# Altium schematic sheet Barrido de temperatura.SchDoc
size A4
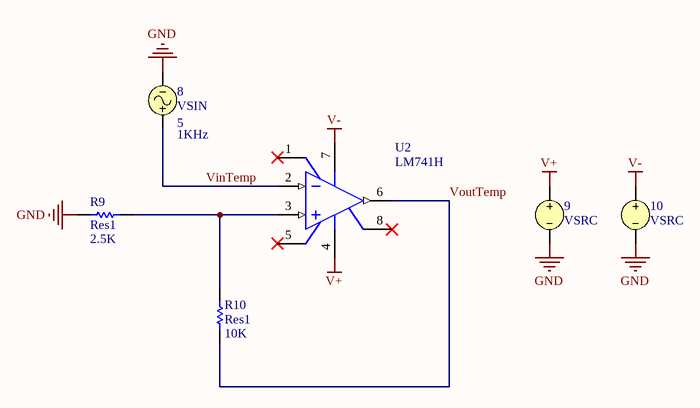
[diagram p0: Barrido de temperatura.SchDoc]

## Parts
8  VSIN  Amplitude: 5  Frequency: 1KHz
9  VSRC
10  VSRC
R9  Res1  value 2.5K  [AXIAL-0.3]
R10  Res1  value 10K  [AXIAL-0.3]
U2  LM741H  [H08C]

## Nets
GND: 8.2 9.2 10.2 R9.1
V+: 9.1 U2.4(V-)
V-: 10.1 U2.7(V+)
VinTemp: 8.1 U2.2(IN-)
VoutTemp: R10.2 U2.6(OUT)
NetR9_2: R9.2 R10.1 U2.3(IN+)

Not connected (* = marked no-connect by the designer): U2 1(OFS_NULL)* 5(OFS_NULL)* 8(NC)*

## Library data of the parts
8 = VSIN: Sinusoidal Voltage Source; Note: PCB Footprint - Not required; Published: 8-Jun-2000; LatestRevisionDate: 15-Nov-2004; LatestRevisionNote: Corrected Netlist.; PackageReference: Not Applicable; Publisher: Altium Limited
9 = VSRC: Voltage Source; Note: PCB Footprint - Not required; Value: +12; Published: 8-Jun-2000; LatestRevisionDate: 17-Jul-2002; LatestRevisionNote: Re-released for DXP Platform.; PackageReference: Not Applicable; Publisher: Altium Limited
10 = VSRC: Voltage Source; Note: PCB Footprint - Not required; Value: -12; Published: 8-Jun-2000; LatestRevisionDate: 17-Jul-2002; LatestRevisionNote: Re-released for DXP Platform.; PackageReference: Not Applicable; Publisher: Altium Limited
R9 R10 = Res1: Resistor; Published: 8-Jun-2000; LatestRevisionDate: 17-Jul-2002; LatestRevisionNote: Re-released for DXP Platform.; PackageReference: AXIAL-0.3; Publisher: Altium Limited; PackageDescription: Axial Device, Thru-Hole; 2 Leads; 0.3 in Pin Spacing
U2 = LM741H: Operational Amplifier, 8-pin TO-99; Manufacturer: National Semiconductor; PackageTopMarking: NSZXYTTE# LM741H; PowerWise: N; CompType: Amplifiers; High-Reliability: Y; Published: 4-Dec-2008; LatestRevisionDate: 13-Jan-2009; LatestRevisionNote: Sim Model Added.; DatasheetVersion: Aug-2000; PackageVersion: revF, Jun-1995; PackageReference: H08C; Publisher: Altium Limited; PackageDescription: Metal Can, TO-99, 8 Lead, .200 Dia., P.C.; Supplier 1: Farnell; Supplier Part Number 1: 1216155; PartNumber: LM741H; RoHS: N; PinCount: 8; Code_JEDEC: TO-99; ComponentLink1Description: LM741 Datasheet; ComponentLink1URL: http://www.national.com/ds/LM/LM741.pdf; ComponentLink2Description: LM741 Web Page; ComponentLink2URL: http://www.national.com/pf/LM/LM741.html; ComponentLink3Description: H08C Package Page; ComponentLink3URL: http://www.national.com/packaging/folders/h08c.html